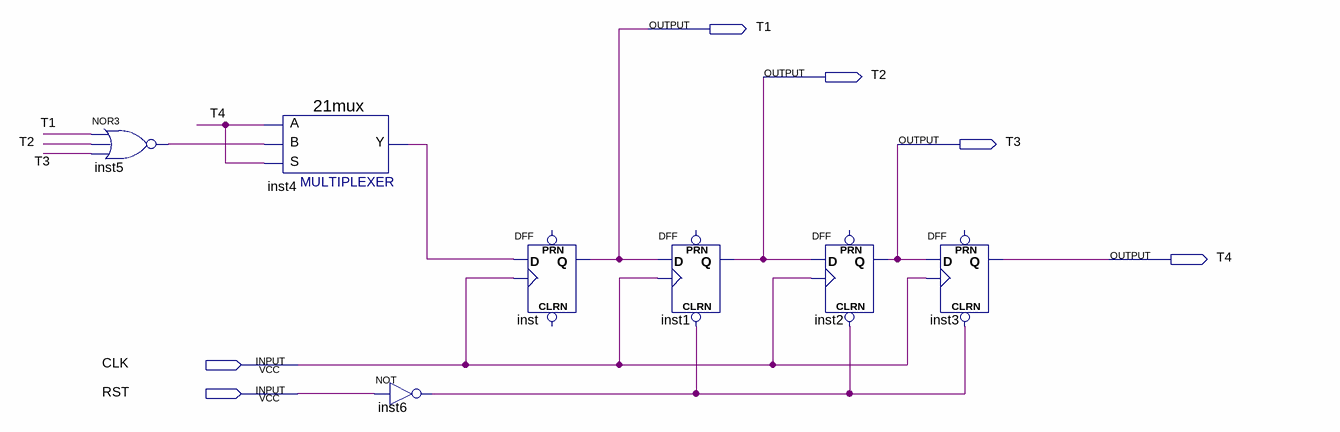
[diagram p0: schematic sheet]
// Quartus schematic FourPulseGenerator.bdf as structural Verilog: 7 symbols, 6 pins
module FourPulseGenerator (
  input  CLK,
  input  RST,
  output T1,
  output T2,
  output T3,
  output T4
);

  wire inst4_y, inst5_out, inst6_out;

  nor inst5 (inst5_out, T1, T2, T3);
  \21mux  inst4 (.S(T4), .B(inst5_out), .A(T4), .Y(inst4_y));
  not inst6 (inst6_out, RST);
  DFF inst (.CLK(CLK), .D(inst4_y), .Q(T1));  // open: CLRN, PRN
  DFF inst1 (.CLRN(inst6_out), .CLK(CLK), .D(T1), .Q(T2));  // open: PRN
  DFF inst2 (.CLRN(inst6_out), .CLK(CLK), .D(T2), .Q(T3));  // open: PRN
  DFF inst3 (.CLRN(inst6_out), .CLK(CLK), .D(T3), .Q(T4));  // open: PRN
endmodule
